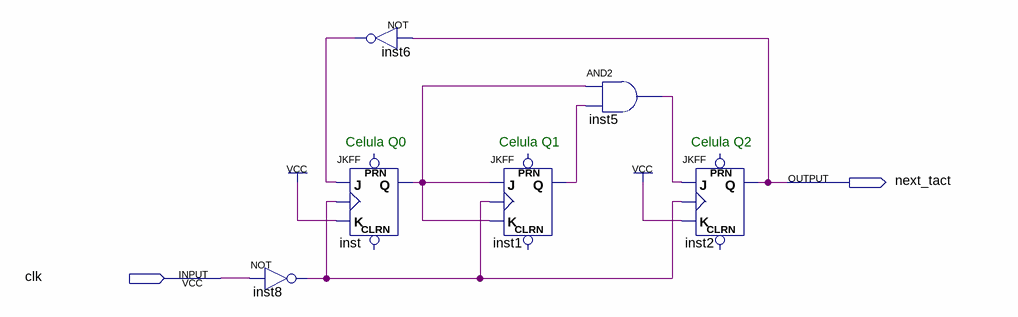
[diagram p0: schematic sheet]
// Quartus schematic divizor_5.bdf as structural Verilog: 6 symbols, 2 pins
module divizor_5 (
  input  clk,
  output next_tact
);

  wire inst1_q, inst5_out, inst6_out, inst8_out, inst_q;

  not inst8 (inst8_out, clk);
  not inst6 (inst6_out, next_tact);
  JKFF inst (.K(1'b1), .J(inst6_out), .CLK(inst8_out), .Q(inst_q));  // open: PRN, CLRN
  JKFF inst1 (.K(inst_q), .J(inst_q), .CLK(inst8_out), .Q(inst1_q));  // open: PRN, CLRN
  and inst5 (inst5_out, inst_q, inst1_q);
  JKFF inst2 (.K(1'b1), .J(inst5_out), .CLK(inst8_out), .Q(next_tact));  // open: PRN, CLRN

  // Notes on the sheet:
  //   Celula Q0
  //   Celula Q1
  //   Celula Q2
endmodule
